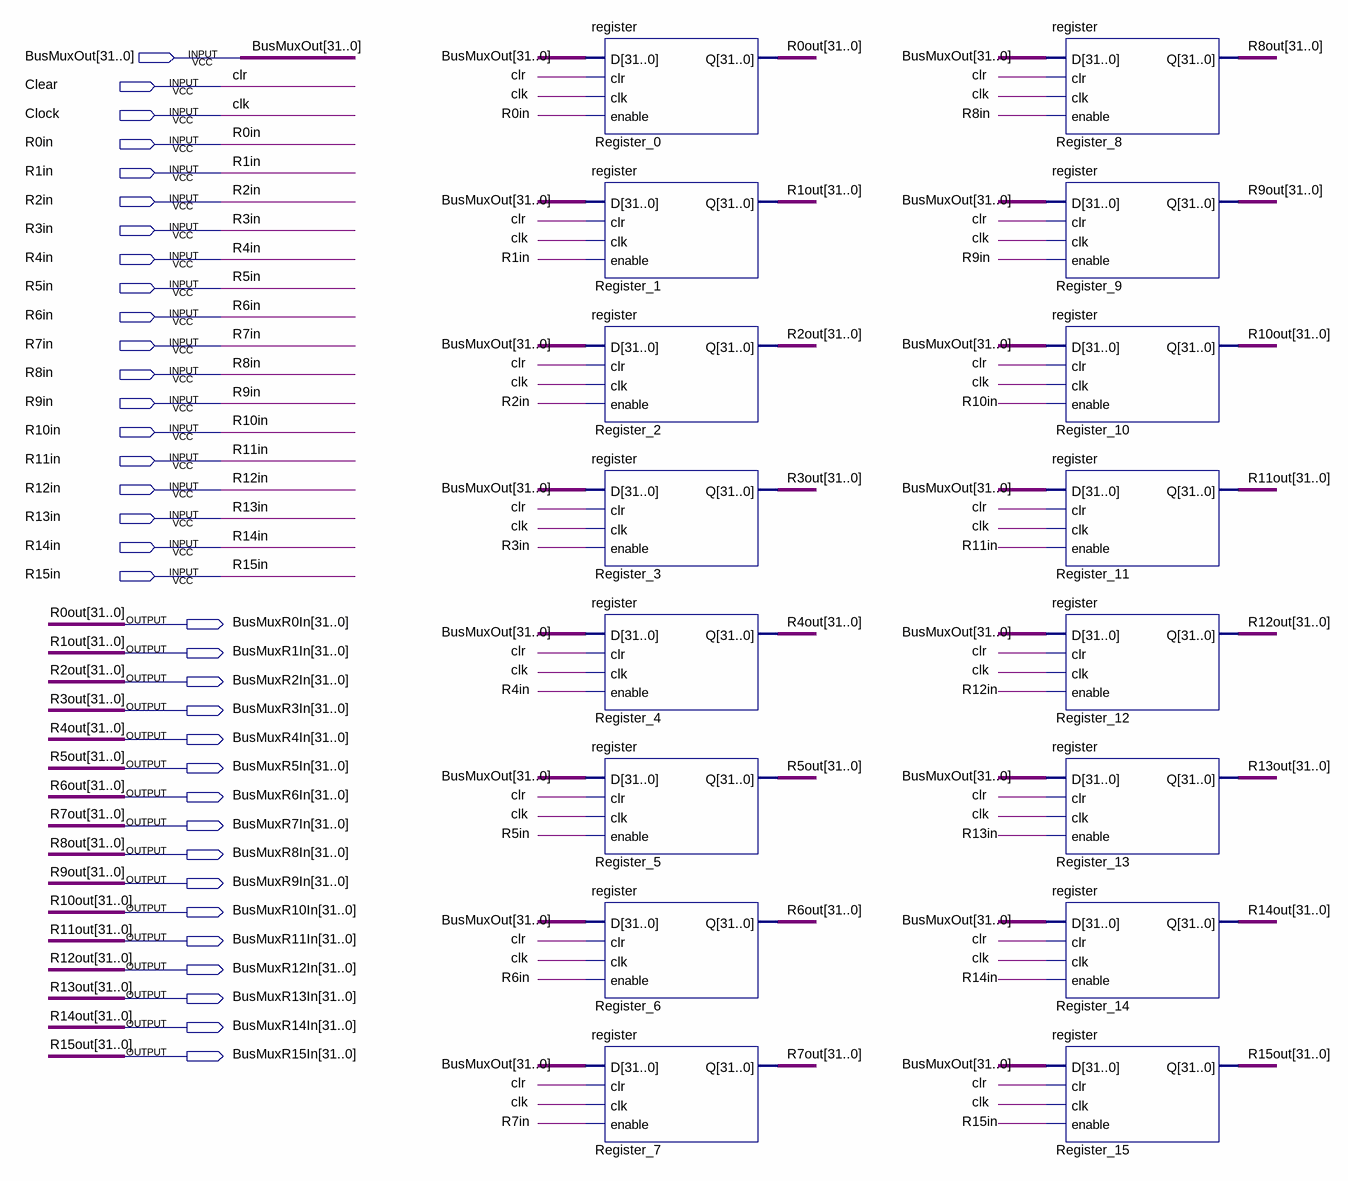
[diagram p0: schematic sheet]
// Quartus schematic Registers.bdf as structural Verilog: 16 symbols, 35 pins
module Registers (
  input  [31:0] BusMuxOut,
  input  Clear,
  input  Clock,
  input  R0in,
  input  R1in,
  input  R2in,
  input  R3in,
  input  R4in,
  input  R5in,
  input  R6in,
  input  R7in,
  input  R8in,
  input  R9in,
  input  R10in,
  input  R11in,
  input  R12in,
  input  R13in,
  input  R14in,
  input  R15in,
  output [31:0] BusMuxR0In,
  output [31:0] BusMuxR1In,
  output [31:0] BusMuxR2In,
  output [31:0] BusMuxR3In,
  output [31:0] BusMuxR4In,
  output [31:0] BusMuxR5In,
  output [31:0] BusMuxR6In,
  output [31:0] BusMuxR7In,
  output [31:0] BusMuxR8In,
  output [31:0] BusMuxR9In,
  output [31:0] BusMuxR10In,
  output [31:0] BusMuxR11In,
  output [31:0] BusMuxR12In,
  output [31:0] BusMuxR13In,
  output [31:0] BusMuxR14In,
  output [31:0] BusMuxR15In
);

  register Register_0 (.D(BusMuxOut), .clr(Clear), .clk(Clock), .enable(R0in), .Q(BusMuxR0In));
  register Register_1 (.D(BusMuxOut), .clr(Clear), .clk(Clock), .enable(R1in), .Q(BusMuxR1In));
  register Register_2 (.D(BusMuxOut), .clr(Clear), .clk(Clock), .enable(R2in), .Q(BusMuxR2In));
  register Register_3 (.D(BusMuxOut), .clr(Clear), .clk(Clock), .enable(R3in), .Q(BusMuxR3In));
  register Register_4 (.D(BusMuxOut), .clr(Clear), .clk(Clock), .enable(R4in), .Q(BusMuxR4In));
  register Register_5 (.D(BusMuxOut), .clr(Clear), .clk(Clock), .enable(R5in), .Q(BusMuxR5In));
  register Register_6 (.D(BusMuxOut), .clr(Clear), .clk(Clock), .enable(R6in), .Q(BusMuxR6In));
  register Register_7 (.D(BusMuxOut), .clr(Clear), .clk(Clock), .enable(R7in), .Q(BusMuxR7In));
  register Register_8 (.D(BusMuxOut), .clr(Clear), .clk(Clock), .enable(R8in), .Q(BusMuxR8In));
  register Register_9 (.D(BusMuxOut), .clr(Clear), .clk(Clock), .enable(R9in), .Q(BusMuxR9In));
  register Register_10 (.D(BusMuxOut), .clr(Clear), .clk(Clock), .enable(R10in), .Q(BusMuxR10In));
  register Register_11 (.D(BusMuxOut), .clr(Clear), .clk(Clock), .enable(R11in), .Q(BusMuxR11In));
  register Register_12 (.D(BusMuxOut), .clr(Clear), .clk(Clock), .enable(R12in), .Q(BusMuxR12In));
  register Register_13 (.D(BusMuxOut), .clr(Clear), .clk(Clock), .enable(R13in), .Q(BusMuxR13In));
  register Register_14 (.D(BusMuxOut), .clr(Clear), .clk(Clock), .enable(R14in), .Q(BusMuxR14In));
  register Register_15 (.D(BusMuxOut), .clr(Clear), .clk(Clock), .enable(R15in), .Q(BusMuxR15In));

  // Other names for the same wires on the sheet: clk = Clock; clr = Clear; R0out[31:0] = BusMuxR0In;
  //   R1out[31:0] = BusMuxR1In; R2out[31:0] = BusMuxR2In; R3out[31:0] = BusMuxR3In; R4out[31:0] = BusMuxR4In;
  //   R5out[31:0] = BusMuxR5In; R6out[31:0] = BusMuxR6In; R7out[31:0] = BusMuxR7In; R8out[31:0] = BusMuxR8In;
  //   R9out[31:0] = BusMuxR9In; R10out[31:0] = BusMuxR10In; R11out[31:0] = BusMuxR11In; R12out[31:0] = BusMuxR12In;
  //   R13out[31:0] = BusMuxR13In; R14out[31:0] = BusMuxR14In; R15out[31:0] = BusMuxR15In
endmodule
